# EAGLE design tcd-filter (EAGLE 5.11)
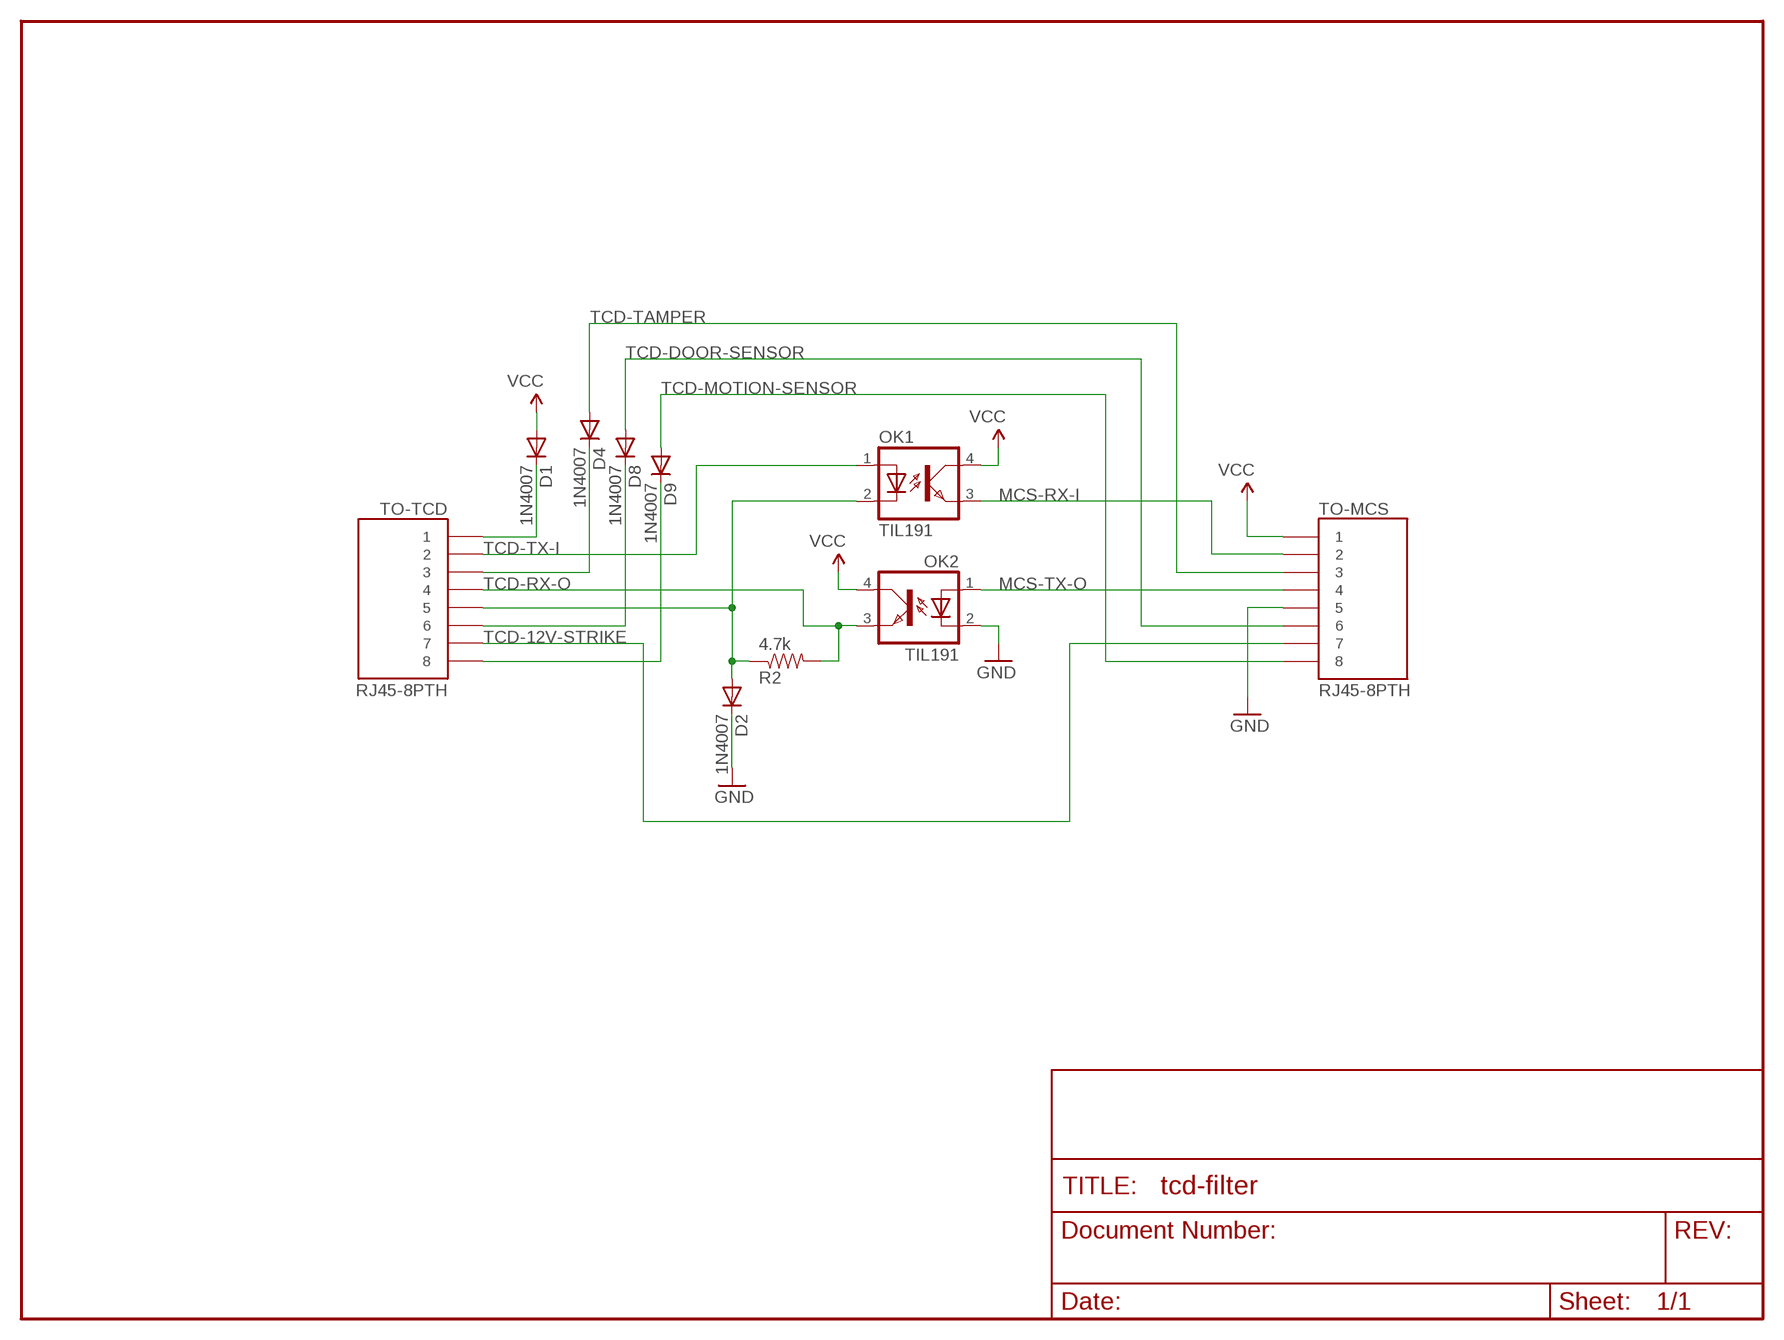
[diagram p0: schematic, sheet 1]

## Parts
D1  1N4007  DIODEPTH  [DIODE-1N4001]
D2  1N4007  DIODEPTH  [DIODE-1N4001]
D4  1N4007  DIODEPTH  [DIODE-1N4001]
D8  1N4007  DIODEPTH  [DIODE-1N4001]
D9  1N4007  DIODEPTH  [DIODE-1N4001]
OK1  TIL191  [DIL04]
OK2  TIL191  [DIL04]
R2  4.7k  RESISTORPTH-1/4W  [AXIAL-0.4]
TO-MCS  RJ45-8PTH  [RJ45-8]
TO-TCD  RJ45-8PTH  [RJ45-8]

## Nets
GND: D2.C OK2.2(C) TO-MCS.5
MCS-RX-I: OK1.3(EMIT) TO-MCS.2
MCS-TX-O: OK2.1(A) TO-MCS.4
N$4: D2.A OK1.2(C) R2.P$1 TO-TCD.5
N$5: D1.C TO-TCD.1
N$7: D4.C TO-TCD.3
N$8: D8.C TO-TCD.6
N$9: D9.C TO-TCD.8
TCD-12V-STRIKE: TO-MCS.7 TO-TCD.7
TCD-DOOR-SENSOR: D8.A TO-MCS.6
TCD-MOTION-SENSOR: D9.A TO-MCS.8
TCD-RX-O: OK2.3(EMIT) R2.P$2 TO-TCD.4
TCD-TAMPER: D4.A TO-MCS.3
TCD-TX-I: OK1.1(A) TO-TCD.2
VCC: D1.A OK1.4(COL) OK2.4(COL) TO-MCS.1

## Library data of the parts
D1 D2 D4 D8 D9 = SparkFun:DIODE: Diode These are standard reverse protection diodes and small signal diodes. SMA package can handle up to about 1A. SOD-323 can handle about 200mA. What the SOD-323 package when ordering, there are some mfgs out there that are 5-pin packages.
OK1 OK2 = optocoupler:TIL191: TEXAS INSTRUMENTS OPTO COUPLER; OC_FARNELL: 1683363; OC_NEWARK: unknown
R2 = SparkFun:RESISTOR: Resistor Basic schematic elements and footprints for 0603, 1206, and PTH resistors.
TO-MCS TO-TCD = SparkFun:RJ45-8: RJ45 Jack Simple RJ45, 8-pin connection - connector for common Cat5, Cat5e, and Cat6 Ethernet cables. Footprint not yet proven in production. Connector sku is PRT-00643; Breakout PCB sku is BOB-00716.

## Board
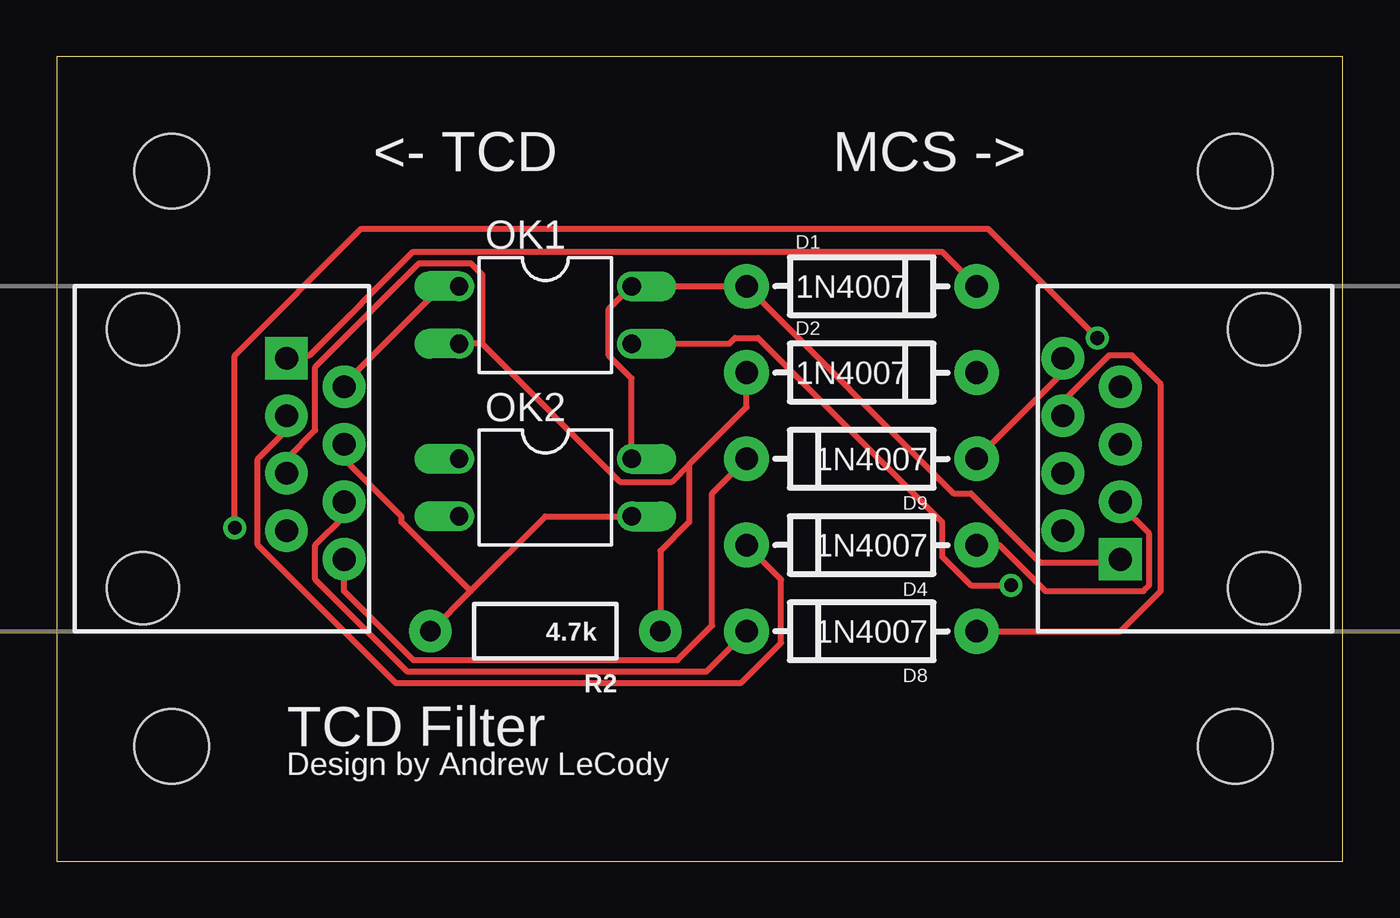
[diagram p1: board, top side]
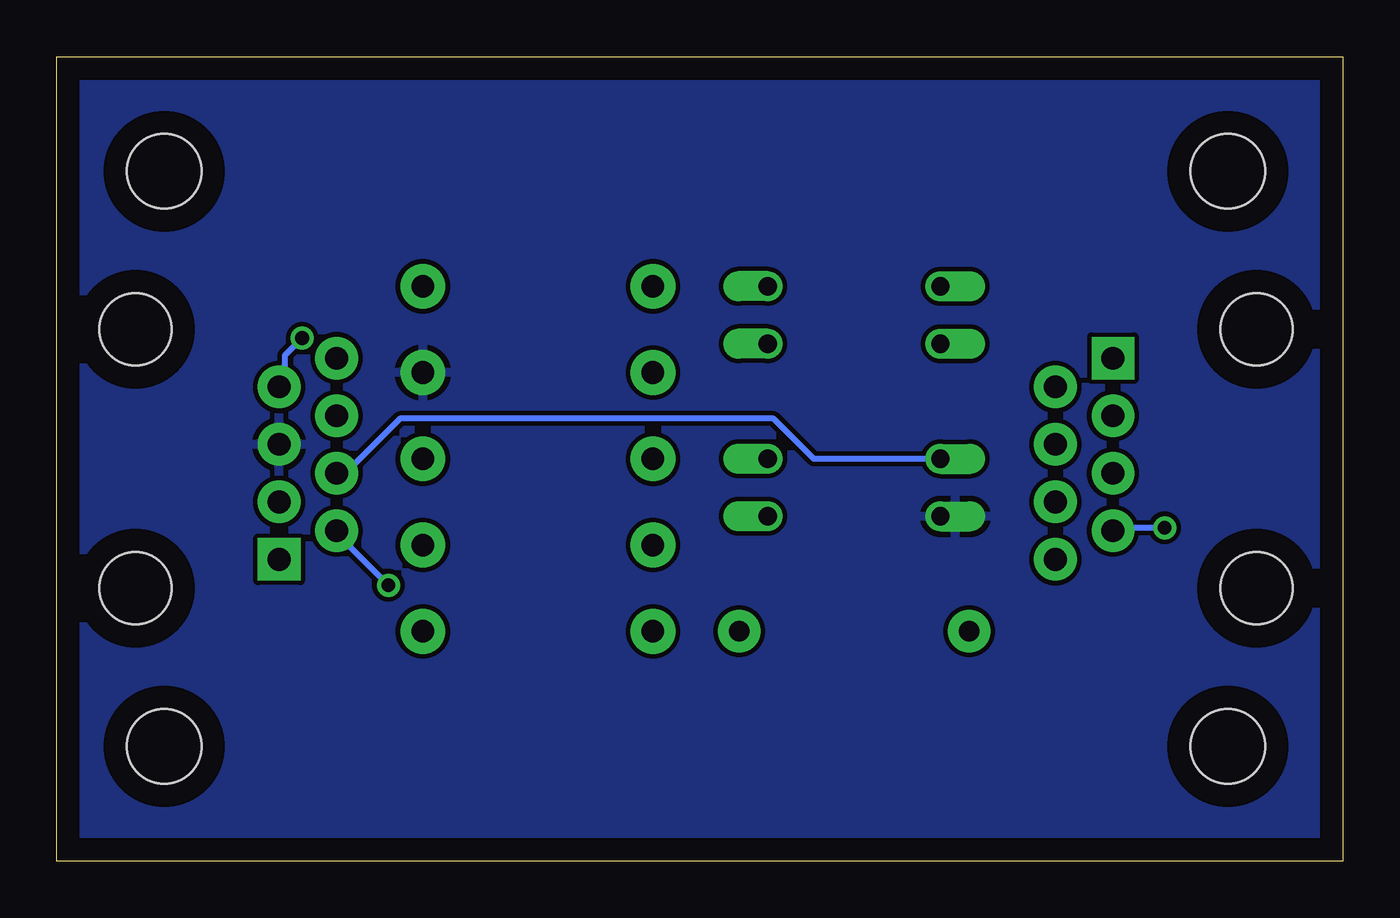
[diagram p2: board, bottom side, seen from below]

Size 56.82 x 35.55 mm. Coordinates in mm from the lower left corner, seen from the top.
Outline: 0,0 56.82,0 56.82,35.55 0,35.55 0,0
Copper layers (1*16): Top 0.035mm / dielectric 1.5mm / Bottom 0.035mm
Design rules "default": minimum track width 10mil, minimum drill 24mil, track to track 8mil, track to pad 8mil, pad to pad 8mil, via to via 8mil, smd to smd 8mil, copper to edge 40mil, drill to drill 8mil, minimum pad ring 10mil, minimum via ring 8mil, stop-mask expansion 4mil, vias tented up to drill 0mil, thermal gap 10mil

### Footprints (pad centres in the part's own frame; a part is rotated, then mirrored left to right if it is on the bottom)
DIODE-1N4001 = drill 1 pad 1.981 round: A -5.08,0; C 5.08,0
DIL04 = drill 0.813 offset: 1 -1.27,-3.81; 2 1.27,-3.81; 3 1.27,3.81; 4 -1.27,3.81
AXIAL-0.4 = drill 0.9 pad 1.88 round: P$1 -5.08,0; P$2 5.08,0
RJ45-8 = drill 1 pad 1.88 square: 1 -4.445,6.35 | drill 1 pad 1.88 round: 2 -3.175,8.89; 3 -1.905,6.35; 4 -0.635,8.89; 5 0.635,6.35; 6 1.905,8.89; 7 3.175,6.35; 8 4.445,8.89 | hole 3.2: -5.715,0; 5.715,0
STAND-OFF = hole 3.302: 0,0

### Placement (x,y rotation side)
D1  35.56,25.4 0 top
D2  35.56,21.59 0 top
D4  35.56,13.97 180 top
D8  35.56,10.16 180 top
D9  35.56,17.78 180 top
OK1  21.59,24.13 270 top
OK2  21.59,16.51 270 top
R2  21.59,10.16 180 top
TO-MCS  53.34,17.78 90 top
TO-TCD  3.81,17.78 270 top
U$1  [STAND-OFF]  5.08,30.48 0 top
U$2  [STAND-OFF]  5.08,5.08 0 top
U$3  [STAND-OFF]  52.07,5.08 0 top
U$4  [STAND-OFF]  52.07,30.48 0 top

### Tracks (layer width: path | path; a pad name or v marks a point on that pad's centre or on a via)
GND
  pour Bottom: 0,0 0,35.56 57.15,35.56 57.15,0
MCS-RX-I  (via drill 0.61)
  Top 0.254: OK1.3 29.72,22.86 29.97,23.11 30.99,23.11 39.12,14.99 39.12,13.46 40.39,12.19 v42.16,12.19
  Bottom 0.254: v42.16,12.19 44.45,14.48 TO-MCS.2
MCS-TX-O
  Bottom 0.254: OK2.1 23.37,17.78 25.15,19.56 41.66,19.56 43.94,17.27 44.45,17.27 TO-MCS.4
N$4
  Top 0.254: 18.8,22.86 OK1.2 | 18.8,22.86 24.89,16.76 27.18,16.76 27.94,17.53 | 27.94,17.53 30.48,20.07 D2.A | 18.8,22.86 18.8,25.91 18.29,26.42 16,26.42 11.43,21.84 11.43,19.05 10.16,17.78 TO-TCD.5 | R2.P$1 26.67,13.72 27.94,14.99 27.94,17.53
N$5
  Top 0.254: D1.C 39.12,26.92 15.75,26.92 11.18,22.35 10.16,22.35 TO-TCD.1
N$7
  Top 0.254: D4.C 32,12.45 32,9.65 30.23,7.87 14.99,7.87 8.89,13.97 8.89,17.78 10.16,19.05 TO-TCD.3
N$8
  Top 0.254: D8.C 28.7,8.38 15.49,8.38 11.43,12.45 11.43,13.97 12.7,15.24 TO-TCD.6
N$9
  Top 0.254: D9.C 28.96,16.26 28.96,10.41 27.43,8.89 15.75,8.89 12.7,11.94 TO-TCD.8
TCD-12V-STRIKE  (via drill 0.61)
  Top 0.254: v7.87,14.73 7.87,22.35 13.46,27.94 41.15,27.94 v45.97,23.11
  Bottom 0.254: v7.87,14.73 10.16,14.73 TO-TCD.7 | v45.97,23.11 46.74,22.35 46.74,21.34 46.99,21.08 TO-MCS.7
TCD-DOOR-SENSOR
  Top 0.254: D8.A 46.99,10.16 48.77,11.94 48.77,21.08 47.5,22.35 46.48,22.35 44.45,20.32 TO-MCS.6
TCD-MOTION-SENSOR
  Top 0.254: D9.A 44.45,21.59 TO-MCS.8
TCD-RX-O
  Top 0.254: OK2.3 21.59,15.24 18.29,11.94 | R2.P$2 18.29,11.94 | 18.29,11.94 15.24,14.99 15.24,15.24 12.7,17.78 TO-TCD.4
TCD-TAMPER
  Top 0.254: D4.A 41.66,13.97 43.69,11.94 48.01,11.94 48.26,12.19 48.26,14.48 46.99,15.75 TO-MCS.3
TCD-TX-I
  Top 0.254: OK1.1 17.02,25.4 12.7,21.08 TO-TCD.2
VCC
  Top 0.254: OK2.4 25.4,21.34 24.38,22.35 24.38,24.38 OK1.4 D1.A 39.62,16.26 40.39,16.26 43.43,13.21 46.99,13.21 TO-MCS.1

### Text on the board
tPlace: <- TCD | MCS -> | TCD Filter | Design by Andrew LeCody